# EAGLE schematic toslink_reciever (EAGLE 7.7.0)
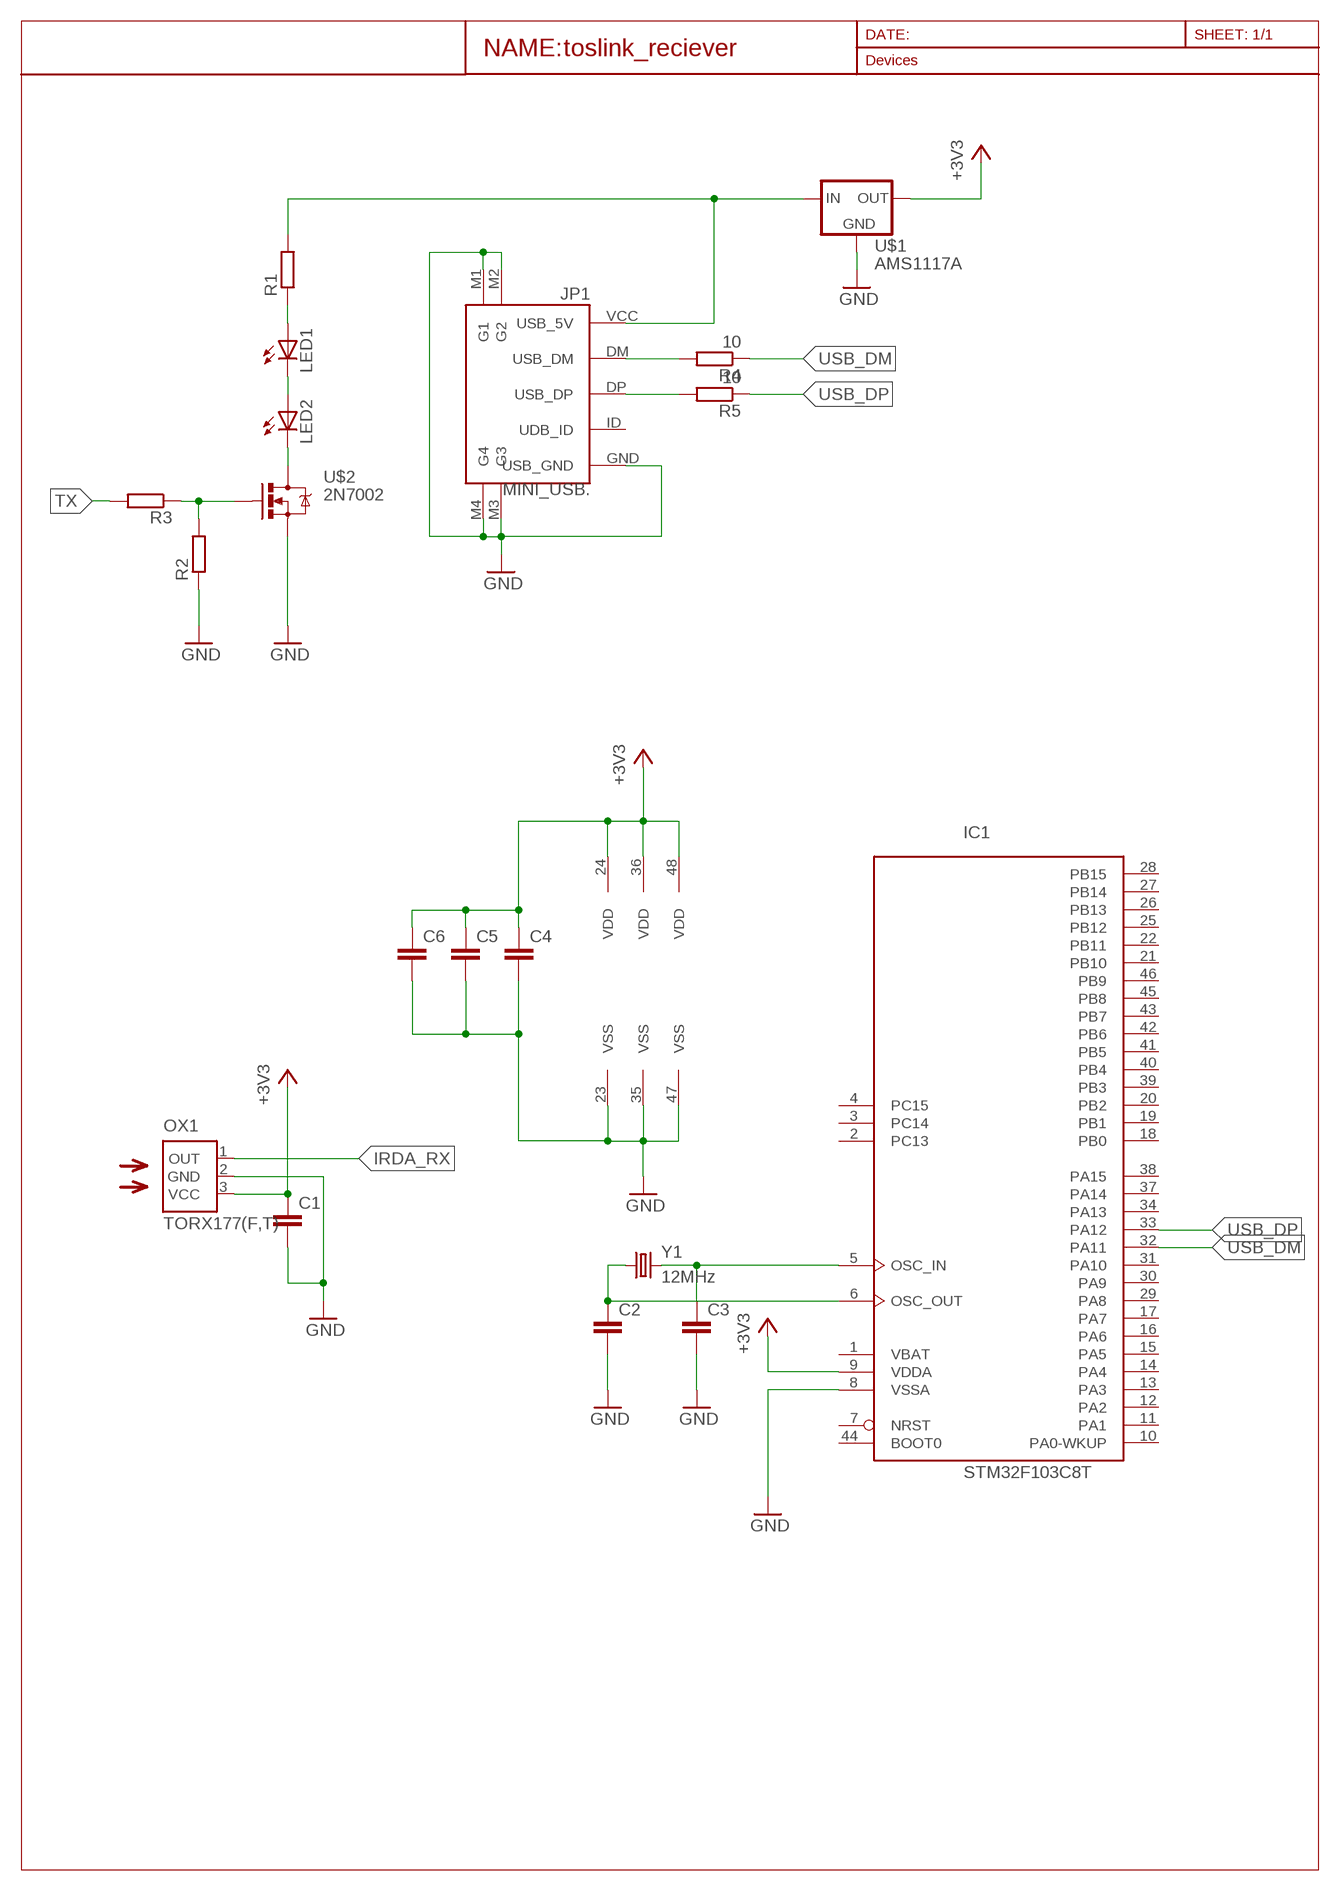
[diagram p0: schematic, sheet 1]

## Parts
C1  CC0805  [C0805]
C2  CC0603  [C0603]
C3  CC0603  [C0603]
C4  CC0805  [C0805]
C5  CC0805  [C0805]
C6  CC0805  [C0805]
IC1  STM32F103C8T  [LQFP48]
JP1  MINI_USB.  [32005-201]
LED1  LED5MM  [LED5MM]
LED2  LED5MM  [LED5MM]
OX1  TORX177(F,T)  [TORX]
R1  R0603  [0603]
R2  R0603  [0603]
R3  R0603  [0603]
R4  10  R0603  [0603]
R5  10  R0603  [0603]
U$1  AMS1117A  [DPACK]
U$2  2N7002  [SOT23]
Y1  12MHz  CRYSTALCRYSTAL-SMD-5X3-12MHZ  [CRYSTAL-SMD-5X3]

## Nets
+3V3: C1.1 C4.1 C5.1 C6.1 IC1.9(VDDA) IC1.24(VDD) IC1.36(VDD) IC1.48(VDD) OX1.3(VCC) U$1.2(OUT)
GND: C1.2 C2.2 C3.2 C4.2 C5.2 C6.2 IC1.8(VSSA) IC1.23(VSS) IC1.35(VSS) IC1.47(VSS) JP1.GND(USB_GND) JP1.M1(G1) JP1.M2(G2) JP1.M3(G3) JP1.M4(G4) OX1.2(GND) R2.1 U$1.1(GND) U$2.2(S)
IRDA_RX: OX1.1(OUT)
N$1: LED1.K(C) LED2.A
N$2: C3.1 IC1.5(OSC_IN) Y1.3
N$3: C2.1 IC1.6(OSC_OUT) Y1.1
N$4: LED2.K(C) U$2.3(D)
N$6: LED1.A R1.1
N$7: R2.2 R3.1 U$2.1(G)
N$8: JP1.VCC(USB_5V) R1.2 U$1.3(IN)
N$10: JP1.DP(USB_DP) R5.2
N$11: JP1.DM(USB_DM) R4.2
TX: R3.2
USB_DM: IC1.32(PA11) R4.1
USB_DP: IC1.33(PA12) R5.1
Unconnected: IC1.2(PC13) IC1.3(PC14) IC1.4(PC15) IC1.7(NRST) IC1.10(PA0-WKUP) IC1.11(PA1) IC1.12(PA2) IC1.13(PA3) IC1.14(PA4) IC1.15(PA5) IC1.16(PA6) IC1.17(PA7) IC1.18(PB0) IC1.19(PB1) IC1.20(PB2) IC1.21(PB10) IC1.22(PB11) IC1.25(PB12) IC1.26(PB13) IC1.27(PB14) IC1.28(PB15) IC1.29(PA8) IC1.30(PA9) IC1.31(PA10) IC1.34(PA13) IC1.37(PA14) IC1.38(PA15) IC1.39(PB3) IC1.40(PB4) IC1.41(PB5) IC1.42(PB6) IC1.43(PB7) IC1.44(BOOT0) IC1.45(PB8) IC1.46(PB9) JP1.ID(UDB_ID)

## Power pins joined to a net without a drawn wire
VBAT: IC1.1(VBAT)

## Library data of the parts
C1-C6 = smalsmd:C: Capacitor
IC1 = micro-stm_v3:STM32F103C*T: ARM 32-bit Cortex™-M3 CPU 72 MHz maximum frequency 16 to 128 Kbytes of Flash memory 6 to 20 kbytes of SRAM 37 GPIOs 2.0 to 3.6 V application supply
JP1 = connectors:MINI_USB
LED1 LED2 = led:LED: LED OSRAM: - CHIPLED LG R971, LG N971, LY N971, LG Q971, LY Q971, LO R971, LY R971 LH N974, LH R974 LS Q976, LO Q976, LY Q976 LO Q996 - Hyper CHIPLED LW Q18S LB Q993, LB Q99A, LB R99A - SideLED LS A670, LO A670, LY A670, LG A670, LP A670 LB A673, LV A673, LT A673, LW A673 LH A674 LY A675 LS A676, LA A676, LO A676, LY A676, LW A676 LS A679, LY A679, LG A679 - Hyper Micro SIDELED® LS Y876, LA Y876, LO Y876, LY Y876 LT Y87S - SmartLED LW L88C, LW L88S LB L89C, LB L89S, LG L890 LS L89K, LO L89K, LY L89K LS L896, LA L896, LO L896, LY L896 - TOPLED LS T670, LO T670, LY T670, LG T670, LP T670 LSG T670, LSP T670, LSY T670, LOP T670, LYG T670 LG T671, LOG T671, LSG T671 LB T673, LV T673, LT T673, LW T673 LH T674 LS T676, LA T676, LO T676, LY T676, LB T676, LH T676, LSB T676, LW T676 LB T67C, LV T67C, LT T67C, LS T67K, LO T67K, LY T67K, LW E67C LS E67B, LA E67B, LO E67B, LY E67B, LB E67C, LV E67C, LT E67C LW T67C LS T679, LY T679, LG T679 LS T770, LO T770, LY T770, LG T770, LP T770 LB T773, LV T773, LT T773, LW T773 LH T774 LS E675, LA E675, LY E675, LS T675 LS T776, LA T776, LO T776, LY T776, LB T776 LHGB T686 LT T68C, LB T68C - Hyper Mini TOPLED® LB M676 - Mini TOPLED Santana® LG M470 LS M47K, LO M47K, LY M47K Source: http://www.osram.convergy.de LUXEON: - LUMILED® LXK2-PW12-R00, LXK2-PW12-S00, LXK2-PW14-U00, LXK2-PW14-V00 LXK2-PM12-R00, LXK2-PM12-S00, LXK2-PM14-U00 LXK2-PE12-Q00, LXK2-PE12-R00, LXK2-PE12-S00, LXK2-PE14-T00, LXK2-PE14-U00 LXK2-PB12-K00, LXK2-PB12-L00, LXK2-PB12-M00, LXK2-PB14-N00, LXK2-PB14-P00, LXK2-PB14-Q00 LXK2-PR12-L00, LXK2-PR12-M00, LXK2-PR14-Q00, LXK2-PR14-R00 LXK2-PD12-Q00, LXK2-PD12-R00, LXK2-PD12-S00 LXK2-PH12-R00, LXK2-PH12-S00 LXK2-PL12-P00, LXK2-PL12-Q00, LXK2-PL12-R00 Source: www.luxeon.com KINGBRIGHT: KA-3528ASYC Source: www.kingbright.com
OX1 = toslink:TORX177(F,T): FIBER OPTIC RECEIVING MODULE
R1-R5 = smalsmd:R
U$1 = stabil:AMS1117A
U$2 = smalsmd:2N7002
Y1 = SparkFun-FreqCtrl:CRYSTAL: Various standard crystals. Proven footprints.; PROD_ID: XTAL-08297